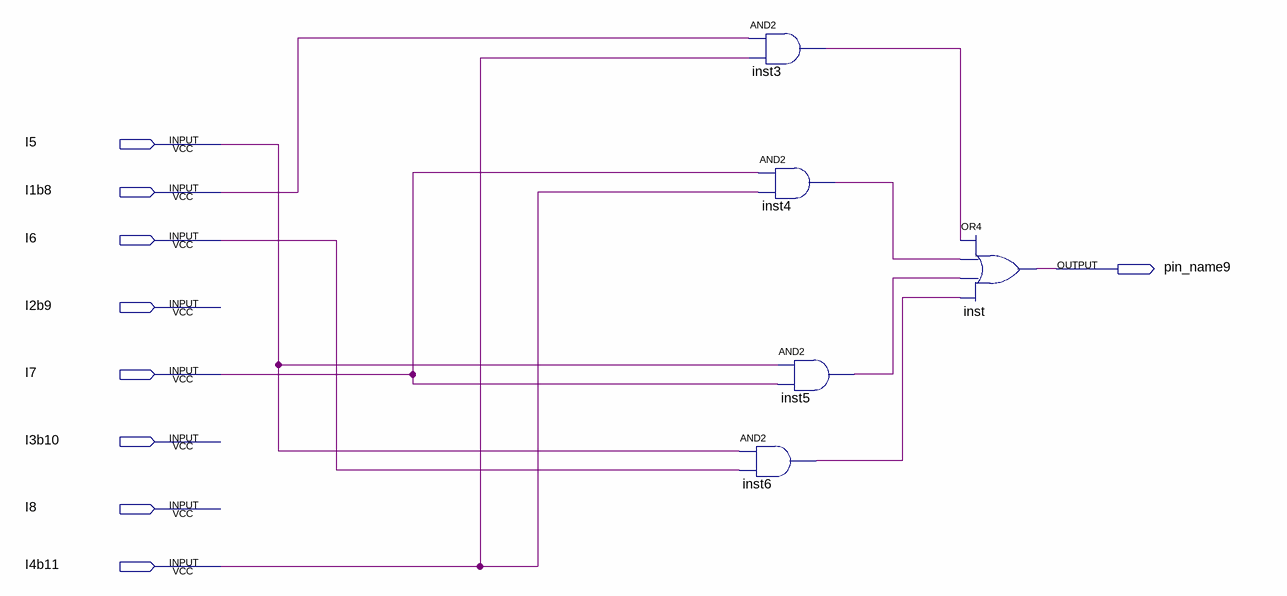
[diagram p0: schematic sheet]
// Quartus schematic funce.bdf as structural Verilog: 5 symbols, 9 pins
module funce (
  input  I5,
  input  I1b8,
  input  I6,
  input  I2b9,
  input  I7,
  input  I3b10,
  input  I8,
  input  I4b11,
  output pin_name9
);

  wire inst3_out, inst4_out, inst5_out, inst6_out;

  and inst3 (inst3_out, I1b8, I4b11);
  and inst4 (inst4_out, I7, I4b11);
  and inst5 (inst5_out, I5, I7);
  and inst6 (inst6_out, I5, I6);
  or inst (pin_name9, inst3_out, inst4_out, inst5_out, inst6_out);
endmodule
